# EAGLE design 1tm32 (EAGLE 9.6.2)
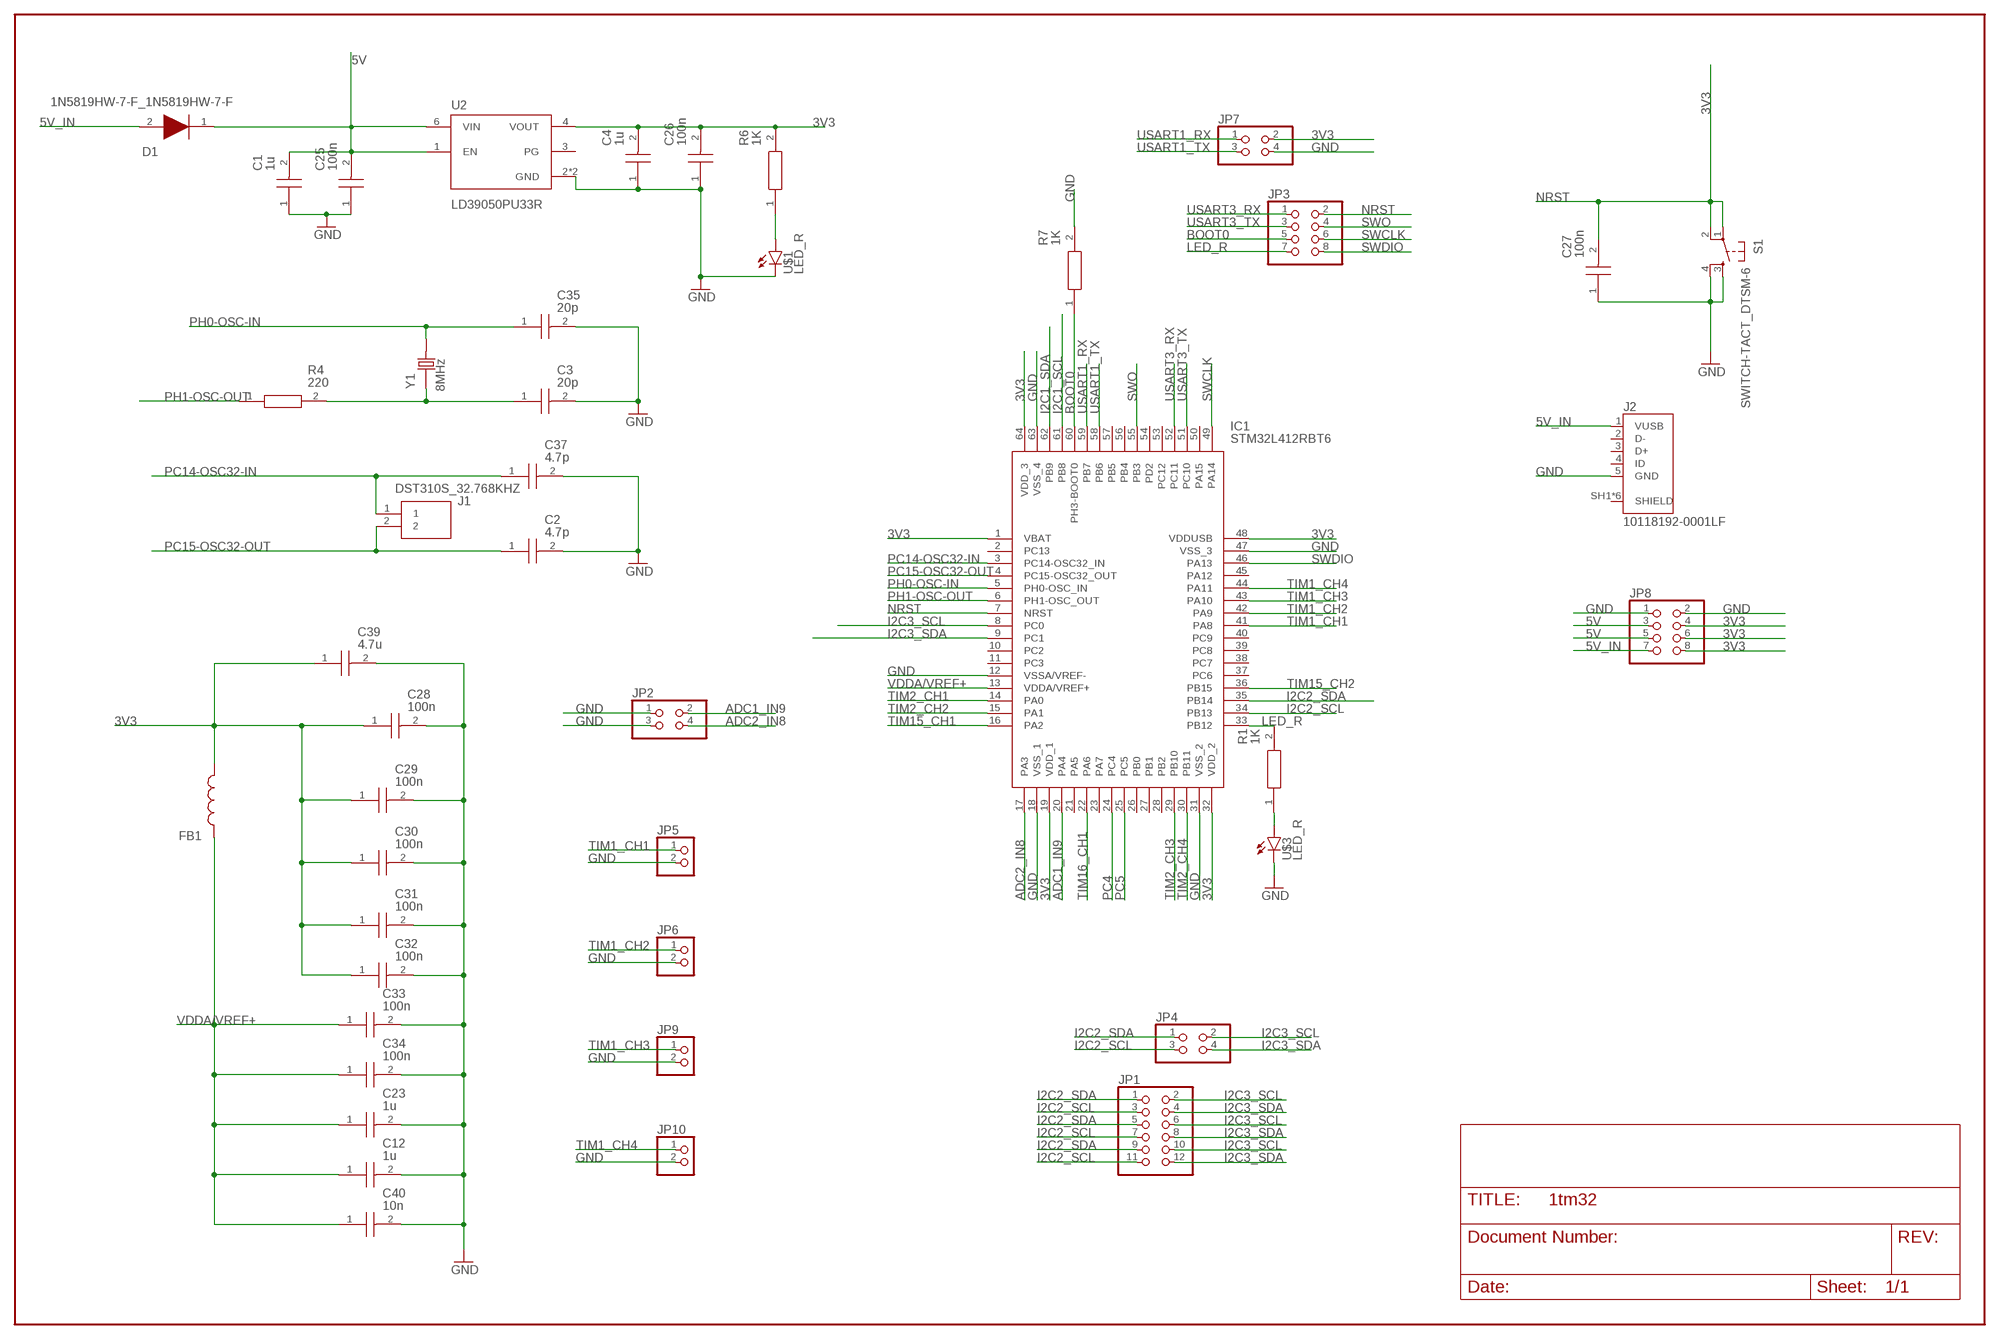
[diagram p0: schematic, sheet 1]

## Parts
C1  1u  GRM219R61H105KA73D  [CAPC2012X95N]
C2  4.7p  GQM2195C2E4R7BB12D  [CAPC2012X100N]
C3  20p  CC0402KPX7R7BB104  [CAPC1005X55N]
C4  1u  GRM219R61H105KA73D  [CAPC2012X95N]
C12  1u  GRM219R61H105KA73D  [CAPC2012X95N]
C23  1u  GRM219R61H105KA73D  [CAPC2012X95N]
C25  100n  GRT31C5C2A104JA12L  [CAPC3216X180N]
C26  100n  GRT31C5C2A104JA12L  [CAPC3216X180N]
C27  100n  GRT31C5C2A104JA12L  [CAPC3216X180N]
C28  100n  GRT31C5C2A104JA12L  [CAPC3216X180N]
C29  100n  GRT31C5C2A104JA12L  [CAPC3216X180N]
C30  100n  GRT31C5C2A104JA12L  [CAPC3216X180N]
C31  100n  GRT31C5C2A104JA12L  [CAPC3216X180N]
C32  100n  GRT31C5C2A104JA12L  [CAPC3216X180N]
C33  100n  GRT31C5C2A104JA12L  [CAPC3216X180N]
C34  100n  GRT31C5C2A104JA12L  [CAPC3216X180N]
C35  20p  CC0402KPX7R7BB104  [CAPC1005X55N]
C37  4.7p  GQM2195C2E4R7BB12D  [CAPC2012X100N]
C39  4.7u  GRT21BC71H475KE13L  [CAPC2012X145N]
C40  10n  GRM31CR73A103KW03L  [CAPC3216X180N]
D1  1N5819HW-7-F_1N5819HW-7-F  [1N5819HW-7-F_SOD3716X145N]
FB1  BK1608HS601-T  [BEADC1608X95N]
IC1  STM32L412RBT6  STM32L412RBT6P  [QFP50P1200X1200X160-64N]
J1  DST310S_32.768KHZ  DST310S_32.768KHZ_DST310S_32.768KHZ  [DST310S_32.768KHZ_DST310S32768KHZ]
J2  10118192-0001LF  [AMPHENOL_10118192-0001LF]
JP1  PINHD-2X6  [2X06]
JP2  PINHD-2X2  [2X02]
JP3  PINHD-2X4  [2X04]
JP4  PINHD-2X2  [2X02]
JP5  PINHD-1X2  [1X02]
JP6  PINHD-1X2  [1X02]
JP7  PINHD-2X2  [2X02]
JP8  PINHD-2X4  [2X04]
JP9  PINHD-1X2  [1X02]
JP10  PINHD-1X2  [1X02]
R1  1K  RC0805FR-131KL  [RESC2012X60N]
R4  220  RC0805FR-10220RL  [RESC2012X60N]
R6  1K  RC0805FR-131KL  [RESC2012X60N]
R7  1K  RC0805FR-131KL  [RESC2012X60N]
S1  SWITCH-TACT_DTSM-6  [SWITCH-TACT_DTSM-6]
U2  LD39050PU33R  [SON95P300X300X100-7N]
U$1  LED_R  SML-P12VTT86  [LED_SML-P11UTT86R]
U$3  LED_R  SML-P12VTT86  [LED_SML-P11UTT86R]
Y1  8MHz  ABLS-8.000MHZ-B2-T  [XTAL_ABLS-8.000MHZ-B2-T]

## Nets
3V3: C4.2 C26.2 C28.1 C29.1 C30.1 C31.1 C32.1 C39.1 FB1.2 IC1.1(VBAT) IC1.19(VDD_1) IC1.32(VDD_2) IC1.48(VDDUSB) IC1.64(VDD_3) JP7.2 JP8.4 JP8.6 JP8.8 R6.2 U2.4(VOUT)
5V: C1.2 C25.2 D1.1(K) JP8.3 JP8.5 U2.1(EN) U2.6(VIN)
5V_IN: D1.2(A) J2.1(VUSB) JP8.7
ADC1_IN9: IC1.20(PA4) JP2.2
ADC2_IN8: IC1.17(PA3) JP2.4
BOOT0: IC1.60(PH3-BOOT0) JP3.5 R7.1
GND: C1.1 C2.2 C3.2 C4.1 C12.2 C23.2 C25.1 C26.1 C27.1 C28.2 C29.2 C30.2 C31.2 C32.2 C33.2 C34.2 C35.2 C37.2 C39.2 C40.2 IC1.12(VSSA/VREF-) IC1.18(VSS_1) IC1.31(VSS_2) IC1.47(VSS_3) IC1.63(VSS_4) J2.5(GND) JP2.1 JP2.3 JP5.2 JP6.2 JP7.4 JP8.1 JP8.2 JP9.2 JP10.2 R7.2 S1.3 S1.4 U2.2(GND) U2.7(GND) U$1.C U$3.C
I2C1_SCL: IC1.61(PB8)
I2C1_SDA: IC1.62(PB9)
I2C2_SCL: IC1.34(PB13) JP1.3 JP1.7 JP1.11 JP4.3
I2C2_SDA: IC1.35(PB14) JP1.1 JP1.5 JP1.9 JP4.1
I2C3_SCL: IC1.8(PC0) JP1.2 JP1.6 JP1.10 JP4.2
I2C3_SDA: IC1.9(PC1) JP1.4 JP1.8 JP1.12 JP4.4
LED_R: IC1.33(PB12) JP3.7 R1.2
N$2: R1.1 U$3.A
N$3: C3.1 R4.2 Y1.1
N$5: R6.1 U$1.A
NRST: C27.2 IC1.7(NRST) JP3.2 S1.1 S1.2
PC4: IC1.24(PC4)
PC5: IC1.25(PC5)
PC14-OSC32-IN: C37.1 IC1.3(PC14-OSC32_IN) J1.1
PC15-OSC32-OUT: C2.1 IC1.4(PC15-OSC32_OUT) J1.2
PH0-OSC-IN: C35.1 IC1.5(PH0-OSC_IN) Y1.2
PH1-OSC-OUT: IC1.6(PH1-OSC_OUT) R4.1
SWCLK: IC1.49(PA14) JP3.6
SWDIO: IC1.46(PA13) JP3.8
SWO: IC1.55(PB3) JP3.4
TIM1_CH1: IC1.41(PA8) JP5.1
TIM1_CH2: IC1.42(PA9) JP6.1
TIM1_CH3: IC1.43(PA10) JP9.1
TIM1_CH4: IC1.44(PA11) JP10.1
TIM2_CH1: IC1.14(PA0)
TIM2_CH2: IC1.15(PA1)
TIM2_CH3: IC1.29(PB10)
TIM2_CH4: IC1.30(PB11)
TIM15_CH1: IC1.16(PA2)
TIM15_CH2: IC1.36(PB15)
TIM16_CH1: IC1.22(PA6)
USART1_RX: IC1.59(PB7) JP7.1
USART1_TX: IC1.58(PB6) JP7.3
USART3_RX: IC1.52(PC11) JP3.1
USART3_TX: IC1.51(PC10) JP3.3
VDDA/VREF+: C12.1 C23.1 C33.1 C34.1 C40.1 FB1.1 IC1.13(VDDA/VREF+)
Unconnected: IC1.2(PC13) IC1.10(PC2) IC1.11(PC3) IC1.21(PA5) IC1.23(PA7) IC1.26(PB0) IC1.27(PB1) IC1.28(PB2) IC1.37(PC6) IC1.38(PC7) IC1.39(PC8) IC1.40(PC9) IC1.45(PA12) IC1.50(PA15) IC1.53(PC12) IC1.54(PD2) IC1.56(PB4) IC1.57(PB5) J2.2(D-) J2.3(D+) J2.4(ID) J2.SH1(SHIELD) J2.SH2(SHIELD) J2.SH3(SHIELD) J2.SH4(SHIELD) J2.SH5(SHIELD) J2.SH6(SHIELD) U2.3(PG)

## Library data of the parts
C1 C4 C12 C23 = GRM219R61H105KA73D(1u):GRM219R61H105KA73D: MURATA - GRM219R61H105KA73D - CAP, MLCC, X5R, 1UF, 50V, 0805 Source: Datasheet <https://datasheet.datasheetarchive.com/originals/distributors/DKDS-10/191852.pdf>; DESCRIPTION: MURATA - GRM219R61H105KA73D - CAP, MLCC, X5R, 1UF, 50V, 0805; HEIGHT: 0.95mm; MANUFACTURER_NAME: Murata Electronics; MANUFACTURER_PART_NUMBER: GRM219R61H105KA73D; MOUSER_PART_NUMBER: 81-GRM219R61H105KA3D; MOUSER_PRICE-STOCK: https://www.mouser.co.uk/ProductDetail/Murata-Electronics/GRM219R61H105KA73D?qs=O5cugoO6nweiD1nCQ5vS9w%3D%3D
C2 C37 = GQM2195C2E4R7BB12D(4_7p):GQM2195C2E4R7BB12D: Capacitor GQM21 L=2.0mm W=1.25mm T=0.85mm Source: Datasheet <https://psearch.en.murata.com/capacitor/product/GQM2195C2E4R7BB12#.html>; DESCRIPTION: Capacitor GQM21 L=2.0mm W=1.25mm T=0.85mm; HEIGHT: 1mm; MANUFACTURER_NAME: Murata Electronics; MANUFACTURER_PART_NUMBER: GQM2195C2E4R7BB12D; MOUSER_PART_NUMBER: 81-GQM2195C2E4R7BB2D; MOUSER_PRICE-STOCK: https://www.mouser.co.uk/ProductDetail/Murata-Electronics/GQM2195C2E4R7BB12D?qs=0JbGSuRBwBOIE8NOw5EJ%2FA%3D%3D
C3 C35 = CC0402KPX7R7BB104(0402cap_foot):CC0402KPX7R7BB104: Multilayer Ceramic Capacitors MLCC - SMD/SMT 16 V 0.1uF X7R 0402 10% Source: Datasheet <https://www.mouser.ca/datasheet/2/447/UPY_NP0X5R_01005_4V_to_25V_V10-3003057.pdf>; DESCRIPTION: Multilayer Ceramic Capacitors MLCC - SMD/SMT 16 V 0.1uF X7R 0402 10%; HEIGHT: 0.55mm; MANUFACTURER_NAME: YAGEO; MANUFACTURER_PART_NUMBER: CC0402KPX7R7BB104; MOUSER_PART_NUMBER: 603-CC402KPX7R7BB104; MOUSER_PRICE-STOCK: https://www.mouser.co.uk/ProductDetail/YAGEO/CC0402KPX7R7BB104?qs=7s%252B3O6pAiyDFg2%2FesnFI7w%3D%3D
C25-C34 = GRT31C5C2A104JA12L(0_1u):GRT31C5C2A104JA12L: Multilayer Ceramic Capacitors MLCC - SMD/SMT Source: Datasheet <https://www.murata.com/en-eu/products/productdetail?partno=GRT31C5C2A104JA12#>; DESCRIPTION: Multilayer Ceramic Capacitors MLCC - SMD/SMT; HEIGHT: 1.8mm; MANUFACTURER_NAME: Murata Electronics; MANUFACTURER_PART_NUMBER: GRT31C5C2A104JA12L; MOUSER_PART_NUMBER: 81-GRT31C5C2A104JA2L; MOUSER_PRICE-STOCK: https://www.mouser.co.uk/ProductDetail/Murata-Electronics/GRT31C5C2A104JA12L?qs=rI7uf1IzohSpYGEFBFd58g%3D%3D
C39 = GRT21BC71H475KE13L(4_7u):GRT21BC71H475KE13L: GRT21BC71H475KE13_ (0805, X7S:EIA, 4.7uF, DC50V) Source: Datasheet <https://search.murata.co.jp/Ceramy/image/img/A01X/G101/ENG/GRT21BC71H475KE13-01.pdf>; DESCRIPTION: GRT21BC71H475KE13_ (0805, X7S:EIA, 4.7uF, DC50V); HEIGHT: 1.45mm; MANUFACTURER_NAME: Murata Electronics; MANUFACTURER_PART_NUMBER: GRT21BC71H475KE13L; MOUSER_PART_NUMBER: 81-GRT21BC71H475KE3L; MOUSER_PRICE-STOCK: https://www.mouser.co.uk/ProductDetail/Murata-Electronics/GRT21BC71H475KE13L?qs=rI7uf1IzohQrtwc9u30k7A%3D%3D
C40 = GRM31CR73A103KW03L(0_01u):GRM31CR73A103KW03L: Murata 3216 GRM 10000pF Ceramic Multilayer Capacitor, 1000 V dc, +125C, X7R Dielectric, +/-10% Source: Datasheet <https://datasheet.datasheetarchive.com/originals/distributors/DKDS-10/192419.pdf>; DESCRIPTION: Murata 3216 GRM 10000pF Ceramic Multilayer Capacitor, 1000 V dc, +125C, X7R Dielectric, +/-10%; HEIGHT: 1.8mm; MANUFACTURER_NAME: Murata Electronics; MANUFACTURER_PART_NUMBER: GRM31CR73A103KW03L; MOUSER_PART_NUMBER: 81-GRM31CR73A103KW3L; MOUSER_PRICE-STOCK: https://www.mouser.co.uk/ProductDetail/Murata-Electronics/GRM31CR73A103KW03L?qs=hNud%2FORuBR1TymPCs4fJcA%3D%3D
D1 = ce-capstone-2022:1N5819HW-7-F_1N5819HW-7-F: Diode Schottky 1A 40V SOD123 Diodes Inc 1N5819HW-7-F, SMT Schottky Diode, 40V 1A, 2-Pin SOD-123 Source: Datasheet <https://datasheet.datasheetarchive.com/originals/distributors/Datasheets-DGA23/1390892.pdf>; ARROW_PART_NUMBER: 1N5819HW-7-F; ARROW_PRICE-STOCK: https://www.arrow.com/en/products/1n5819hw-7-f/diodes-incorporated; DESCRIPTION: Diode Schottky 1A 40V SOD123 Diodes Inc 1N5819HW-7-F, SMT Schottky Diode, 40V 1A, 2-Pin SOD-123; HEIGHT: 1.45mm; MANUFACTURER_NAME: Diodes Inc.; MANUFACTURER_PART_NUMBER: 1N5819HW-7-F; MOUSER_PART_NUMBER: 621-1N5819HW-F; MOUSER_PRICE-STOCK: https://www.mouser.co.uk/ProductDetail/Diodes-Incorporated/1N5819HW-7-F?qs=NQ47qNm99eDyWTEd07miYA%3D%3D
FB1 = ce-capstone:BK1608HS601-T: Ferrite Chip Bead(Lead Free) Source: Datasheet <https://www.tai-tech.com.tw/_upload/files/FCM1608-Series.pdf>; DESCRIPTION: Ferrite Chip Bead(Lead Free); HEIGHT: 0.95mm; MANUFACTURER_NAME: Taiyo Yuden; MANUFACTURER_PART_NUMBER: BK1608HS601-T
IC1 = STM32L412RBT6P:STM32L412RBT6P: ARM Microcontrollers - MCU Source: Datasheet <https://www.st.com/resource/en/datasheet/stm32l412c8.pdf>; DESCRIPTION: ARM Microcontrollers - MCU; HEIGHT: 1.6mm; MANUFACTURER_NAME: STMicroelectronics; MANUFACTURER_PART_NUMBER: STM32L412RBT6P; MOUSER_PART_NUMBER: 511-STM32L412RBT6P; MOUSER_PRICE-STOCK: https://www.mouser.co.uk/ProductDetail/STMicroelectronics/STM32L412RBT6P?qs=l7cgNqFNU1hh%252BU1wOZs5Xg%3D%3D
J1 = ce-capstone-2022:DST310S_32.768KHZ_DST310S_32.768KHZ: SMD Crystal Resonators 32.768KHz +/-20ppm SMD-3215_2P RoHS Source: Datasheet <https://datasheet.lcsc.com/szlcsc/KDS-Daishinku-KDS-32-768KHz-12-5PF-20ppm_C93232.pdf>; DESCRIPTION: SMD Crystal Resonators 32.768KHz +/-20ppm SMD-3215_2P RoHS; HEIGHT: 0.85mm; MANUFACTURER_NAME: KDS Daishinku; MANUFACTURER_PART_NUMBER: DST310S 32.768KHz
J2 = ce-capstone:10118192-0001LF: Single Port 5 Contact Horizontal Right Angle Shielded Micro B USB 2.0 Connector; AVAILABILITY: Unavailable; DESCRIPTION: USB - micro B USB 2.0 Receptacle Connector 5 Position Surface Mount, Right Angle; MF: Amphenol ICC; MP: 10118192-0001LF; PACKAGE: None; PRICE: None
JP1 = pinhead:PINHD-2X6: PIN HEADER
JP2 JP4 JP7 = pinhead:PINHD-2X2: PIN HEADER
JP3 JP8 = pinhead:PINHD-2X4: PIN HEADER
JP5 JP6 JP9 JP10 = pinhead:PINHD-1X2: PIN HEADER
R1 R6 R7 = RC0805FR-131KL:RC0805FR-131KL: Thick Film Resistors - SMD 1 kOhms 250 mW 0805 1% Source: Datasheet <https://datasheet.datasheetarchive.com/originals/distributors/Datasheets_SAMA/902f9e387b938f871d31120f5fc1d65e.pdf>; DESCRIPTION: Thick Film Resistors - SMD 1 kOhms 250 mW 0805 1%; HEIGHT: 0.6mm; MANUFACTURER_NAME: KEMET; MANUFACTURER_PART_NUMBER: RC0805FR-131KL; MOUSER_PART_NUMBER: 603-RC0805FR-131KL; MOUSER_PRICE-STOCK: https://www.mouser.co.uk/ProductDetail/YAGEO/RC0805FR-131KL?qs=m6lXFsvg5e0qJLgmV7HC3Q%3D%3D
R4 = RC0805FR-10220RL:RC0805FR-10220RL: Thick Film Resistors - SMD 220 OHM 1% Source: Datasheet; DESCRIPTION: Thick Film Resistors - SMD 220 OHM 1%; HEIGHT: 0.6mm; MANUFACTURER_NAME: KEMET; MANUFACTURER_PART_NUMBER: RC0805FR-10220RL; MOUSER_PART_NUMBER: 603-RC0805FR-10220RL; MOUSER_PRICE-STOCK: https://www.mouser.co.uk/ProductDetail/YAGEO/RC0805FR-10220RL?qs=m6lXFsvg5e0JpfeoSKi9%252BQ%3D%3D
S1 = ce-capstone-2022:SWITCH-TACT_DTSM-6
U2 = ce-capstone:LD39050PU33R: LD39050 Series 500 mA 3.3 V Fixed Low Noise LDO Voltage Regulator - DFN-6; AVAILABILITY: Unavailable; DESCRIPTION: Linear Voltage Regulator IC 1 Output 500mA 6-DFN _3x3_; MF: STMicroelectronics; MP: LD39050PU33R; PACKAGE: DFN-6 STMicroelectronics; PRICE: None
U$1 U$3 = ce-capstone:SML-P12VTT86: SML-P1 Series Red 0402 Clear 60 mcd 2 V Surface Mount PICOLED LED; AVAILABILITY: Unavailable; DESCRIPTION: Red 630nm LED Indication - Discrete 2V 0402 _1006 Metric_; MF: Rohm; MP: SML-P12VTT86; PACKAGE: 0402 Rohm; PRICE: None
Y1 = ce-capstone:ABLS-8.000MHZ-B2-T: Crystal 8MHz Â±20ppm (Tol) Â±50ppm (Stability) 18pF FUND 80Ohm 2-Pin HC-49/US SMD T/R; AVAILABILITY: Unavailable; DESCRIPTION: 8MHz ±20ppm Crystal 18pF 80 Ohms HC-49/US; MF: Abracon LLC; MP: ABLS-8.000MHZ-B2; PACKAGE: HC-49/US Abracon LLC; PRICE: None

## Board
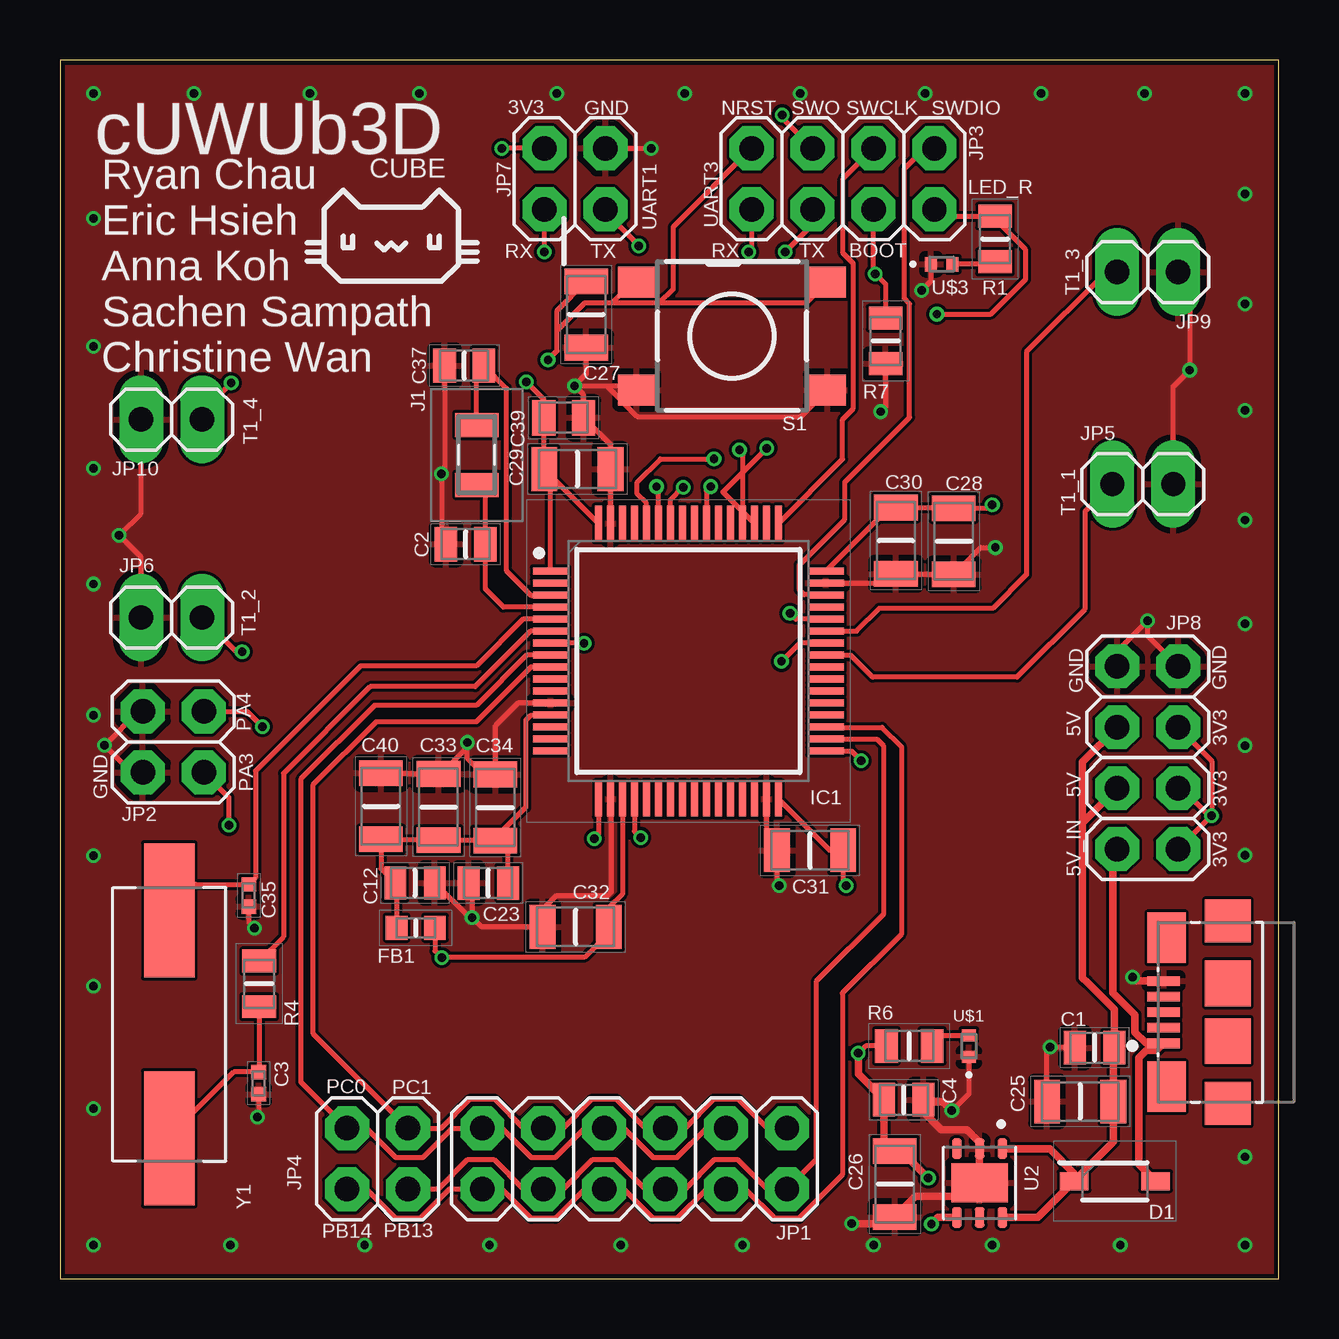
[diagram p1: board, top side]
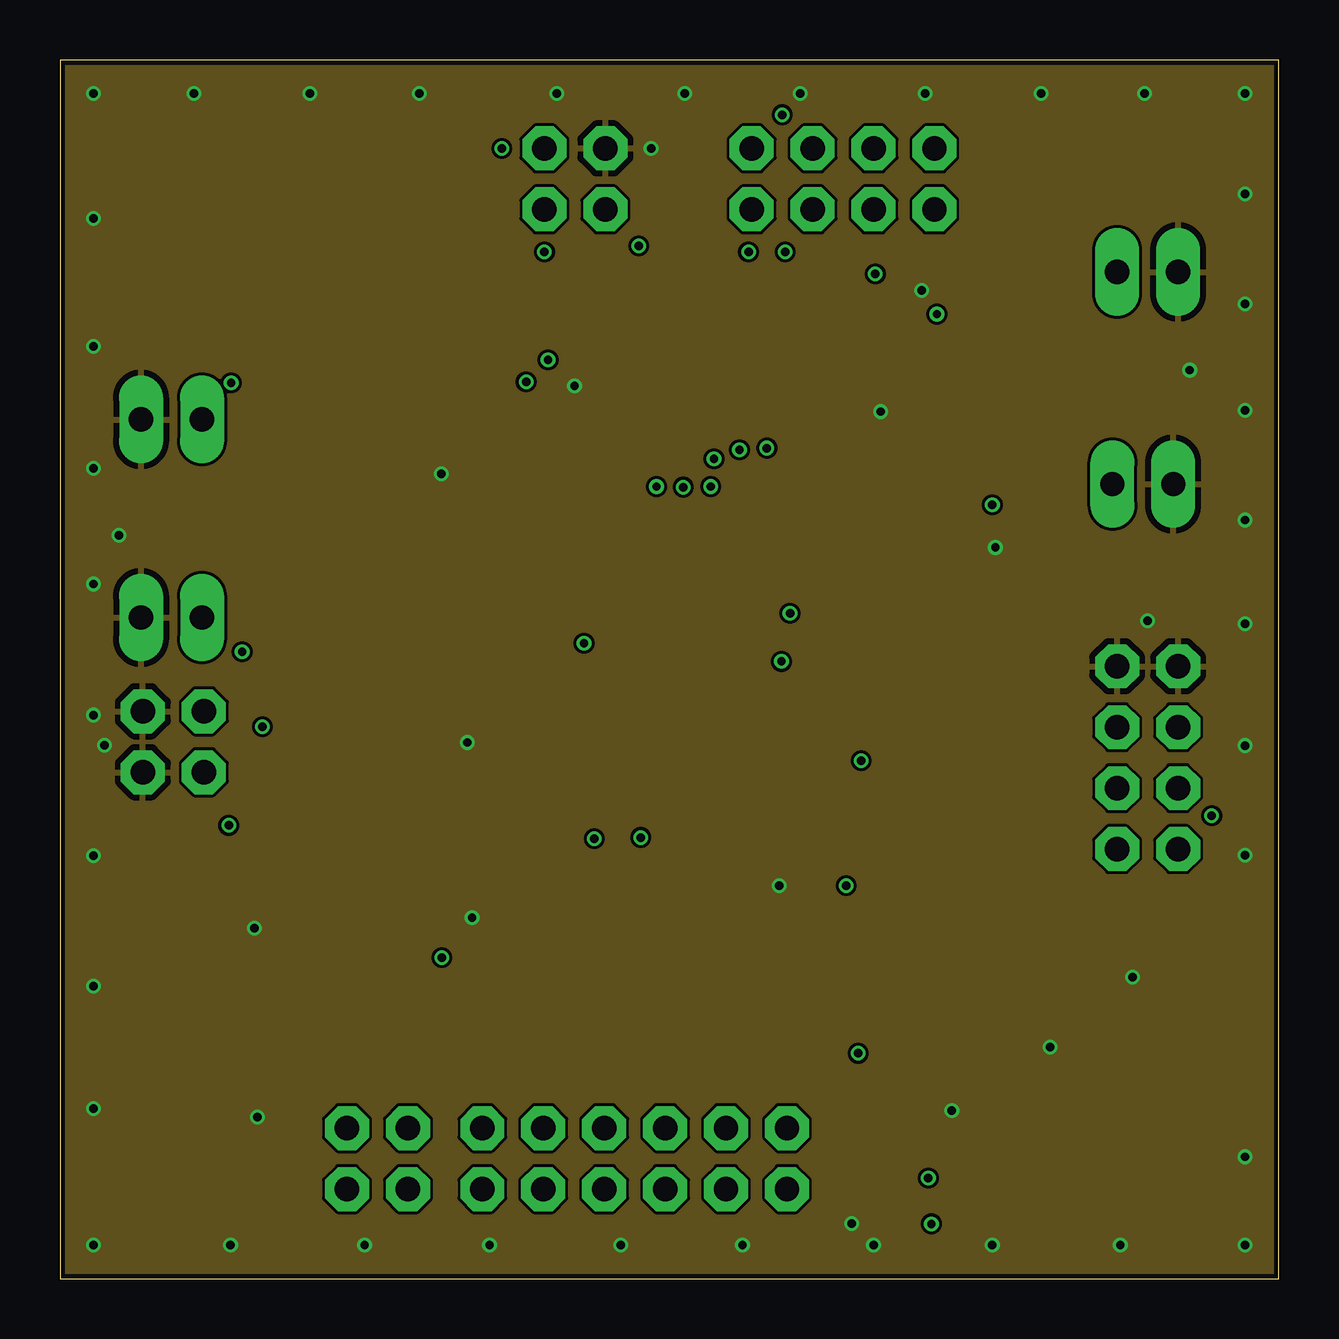
[diagram p2: board, inner layer Route2]
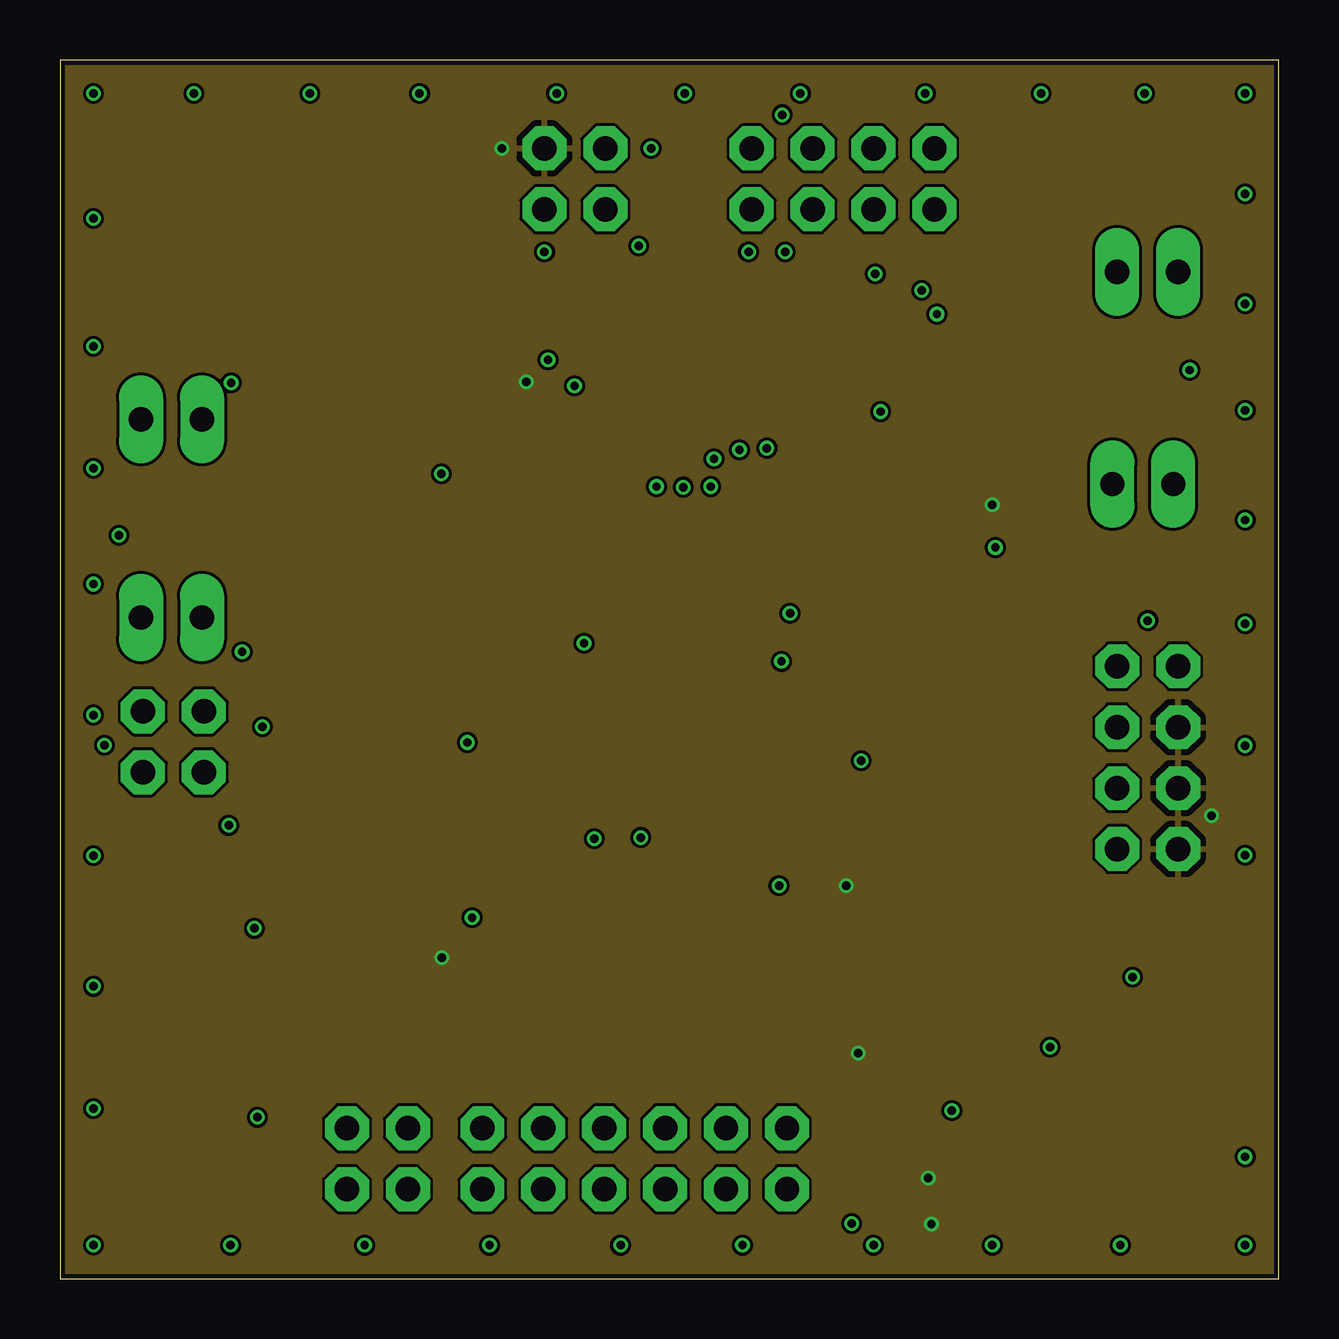
[diagram p3: board, inner layer Route15]
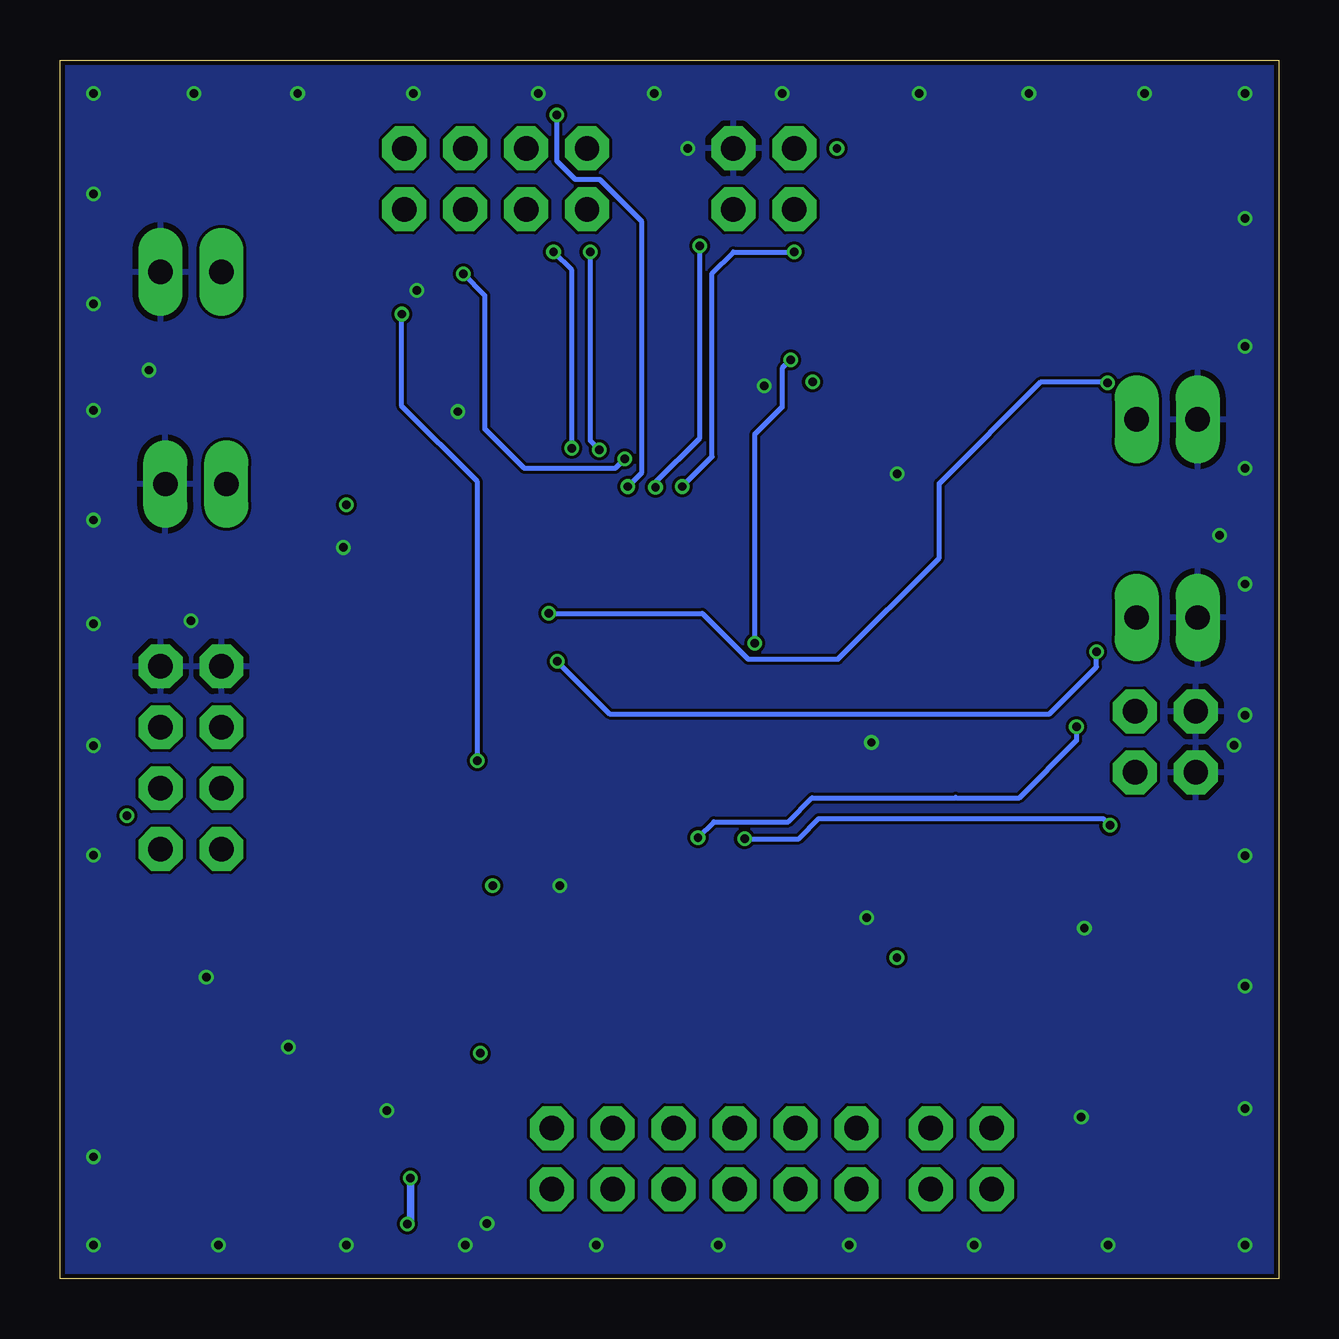
[diagram p4: board, bottom side, seen from below]

Size 50.8 x 50.8 mm. Coordinates in mm from the lower left corner, seen from the top.
Outline: 0,0 50.8,0 50.8,50.8 0,50.8 0,0
Copper layers (1+2*15+16): Top 0.035mm / dielectric 0.2mm / Route2 0.0175mm / dielectric 1.065mm / Route15 0.0175mm / dielectric 0.2mm / Bottom 0.035mm
Design rules "jlcpcb-4layers": minimum track width 3.5mil, minimum drill 0.2mm, track to track 5mil, track to pad 0.2mm, pad to pad 5mil, via to via 0.5mm, smd to smd 5mil, copper to edge 0.2mm, drill to drill 6mil, minimum pad ring 10mil, minimum via ring 0.13mm, stop-mask expansion 0.05mm, vias tented up to drill 16mil, thermal gap 10mil

### Footprints (pad centres in the part's own frame; a part is rotated, then mirrored left to right if it is on the bottom)
CAPC2012X95N = smd 0.91 x 1.39: 1 -0.82,0; 2 0.82,0
CAPC2012X100N = smd 0.94 x 1.43: 1 -0.82,0; 2 0.82,0
CAPC1005X55N = smd 0.6 x 0.62: 1 -0.46,0; 2 0.46,0
CAPC3216X180N = smd 1.07 x 1.82: 1 -1.38,0; 2 1.38,0
CAPC2012X145N = smd 0.97 x 1.47: 1 -0.83,0; 2 0.83,0
1N5819HW-7-F_SOD3716X145N = smd 1.2 x 0.75: 1 -1.7,0; 2 1.7,0
BEADC1608X95N = smd 0.9 x 1: 1 -0.8,0; 2 0.8,0
QFP50P1200X1200X160-64N = smd 1.475 x 0.3: 1 -5.738,3.75; 2 -5.738,3.25; 3 -5.738,2.75; 4 -5.738,2.25; 5 -5.738,1.75; 6 -5.738,1.25; 7 -5.738,0.75; 8 -5.738,0.25; 9 -5.738,-0.25; 10 -5.738,-0.75; 11 -5.738,-1.25; 12 -5.738,-1.75; 13 -5.738,-2.25; 14 -5.738,-2.75; 15 -5.738,-3.25; 16 -5.738,-3.75; 33 5.738,-3.75; 34 5.738,-3.25; 35 5.738,-2.75; 36 5.738,-2.25; 37 5.738,-1.75; 38 5.738,-1.25; 39 5.738,-0.75; 40 5.738,-0.25; 41 5.738,0.25; 42 5.738,0.75; 43 5.738,1.25; 44 5.738,1.75; 45 5.738,2.25; 46 5.738,2.75; 47 5.738,3.25; 48 5.738,3.75 | smd 0.3 x 1.475: 17 -3.75,-5.738; 18 -3.25,-5.738; 19 -2.75,-5.738; 20 -2.25,-5.738; 21 -1.75,-5.738; 22 -1.25,-5.738; 23 -0.75,-5.738; 24 -0.25,-5.738; 25 0.25,-5.738; 26 0.75,-5.738; 27 1.25,-5.738; 28 1.75,-5.738; 29 2.25,-5.738; 30 2.75,-5.738; 31 3.25,-5.738; 32 3.75,-5.738; 49 3.75,5.738; 50 3.25,5.738; 51 2.75,5.738; 52 2.25,5.738; 53 1.75,5.738; 54 1.25,5.738; 55 0.75,5.738; 56 0.25,5.738; 57 -0.25,5.738; 58 -0.75,5.738; 59 -1.25,5.738; 60 -1.75,5.738; 61 -2.25,5.738; 62 -2.75,5.738; 63 -3.25,5.738; 64 -3.75,5.738
DST310S_32.768KHZ_DST310S32768KHZ = smd 1 x 1.8: 1 -1.25,0; 2 1.25,0
AMPHENOL_10118192-0001LF = smd 0.4 x 1.35: 1 -1.3,0; 2 -0.65,0; 3 0,0; 4 0.65,0; 5 1.3,0 | smd 2.1 x 1.6: SH1 -3.1,-0.125; SH2 3.1,-0.125 | smd 1.8 x 1.9: SH3 -3.8,-2.675; SH6 3.8,-2.675 | smd 1.9 x 1.9: SH4 -1.2,-2.675; SH5 1.2,-2.675
2X06 = drill 1.016 octagon: 1 -6.35,-1.27; 2 -6.35,1.27; 3 -3.81,-1.27; 4 -3.81,1.27; 5 -1.27,-1.27; 6 -1.27,1.27; 7 1.27,-1.27; 8 1.27,1.27; 9 3.81,-1.27; 10 3.81,1.27; 11 6.35,-1.27; 12 6.35,1.27
2X02 = drill 1.016 octagon: 1 -1.27,-1.27; 2 -1.27,1.27; 3 1.27,-1.27; 4 1.27,1.27
2X04 = drill 1.016 octagon: 1 -3.81,-1.27; 2 -3.81,1.27; 3 -1.27,-1.27; 4 -1.27,1.27; 5 1.27,-1.27; 6 1.27,1.27; 7 3.81,-1.27; 8 3.81,1.27
1X02 = drill 1.016 long: 1 -1.27,0; 2 1.27,0
RESC2012X60N = smd 0.95 x 1.4: 1 -0.95,0; 2 0.95,0
SWITCH-TACT_DTSM-6 = smd 1.55 x 1.3: 1 -3.975,2.25; 2 3.975,2.25; 3 -3.975,-2.25; 4 3.975,-2.25
SON95P300X300X100-7N = smd 0.84 x 0.4: 1 -1.435,0.95; 2 -1.435,0; 3 -1.435,-0.95; 4 1.435,-0.95; 5 1.435,0; 6 1.435,0.95 | smd 1.625 x 2.365: 7 0,0
LED_SML-P11UTT86R = smd 0.5 x 0.6: A 0.45,0; C -0.45,0
XTAL_ABLS-8.000MHZ-B2-T = smd 5.6 x 2.1: 1 -4.75,0; 2 4.75,0

### Placement (x,y rotation side)
C1  43.12,9.63 0 top
C2  16.91,30.62 180 top
C3  8.28,8.15 270 top
C4  35.17,7.46 180 top
C12  14.8,16.5 0 top
C23  17.85,16.49 180 top
C25  42.52,7.39 0 top
C26  34.8,3.95 90 top
C27  21.94,40.19 90 top
C28  37.25,30.74 270 top
C29  21.57,33.75 0 top
C30  34.84,30.76 270 top
C31  31.26,17.86 180 top
C32  21.49,14.67 180 top
C33  15.78,19.66 90 top
C34  18.15,19.64 90 top
C35  7.87,15.98 270 top
C37  16.85,38.06 180 top
C39  20.99,35.89 0 top
C40  13.38,19.7 90 top
D1  43.97,4.06 0 top
FB1  14.83,14.62 0 top
IC1  26.19,25.74 0 top
J1  17.37,34.34 270 top
J2  46,11.11 90 top
JP1  23.95,5 0 top
JP2  4.72,22.38 270 top
JP3  32.64,45.85 0 top
JP4  13.23,5 0 top
JP5  45.14,33.12 0 top
JP6  4.65,27.56 180 top
JP7  21.46,45.85 0 top
JP8  45.34,21.72 270 top
JP9  45.34,41.96 0 top
JP10  4.65,35.81 180 top
R1  38.98,43.34 90 top
R4  8.3,12.29 270 top
R6  35.4,9.7 180 top
R7  34.41,39.09 270 top
S1  28.02,39.29 0 top
U2  38.33,3.99 270 top
U$1  37.89,9.7 90 top
U$3  36.76,42.28 0 top
Y1  4.56,10.6 90 top

### Tracks (layer width: path | path; a pad name or v marks a point on that pad's centre or on a via)
3V3  (via drill 0.35)
  Top 0.203: 34.8,5.2 C26.2 | IC1.19 23.44,16.02 22.87,15.45 C32.1 22.87,14.41 21.86,13.4 15.93,13.4 v15.91,13.38 15.63,13.66 FB1.2 | R6.2 33.58,9.7 v33.27,9.4 | IC1.64 20.45,33.47 | v19.43,37.39 20.16,36.66 C39.1 20.16,33.77 C29.1 20.19,33.74 20.45,33.47 | IC1.1 20.45,33.47 | IC1.32 32.09,17.86 C31.1 32.64,16.51 v32.77,16.38 | IC1.48 34.58,32.14 C30.1 37.23,32.14 C28.1 38.72,32.12 v38.86,32.26 | JP7.2 v18.41,47.12 | JP8.8 47.94,19.24 | 47.94,19.24 v48.01,19.3 48.01,21.59 JP8.4 | JP8.6 46.74,20.45 47.94,19.24
  Top 0.305: v33.27,9.4 33.27,8.53 C4.2 34.35,5.55 34.8,5.1 34.8,5.2 35.19,5.2 v36.2,4.19 | U2.4 36.59,2.55 v36.32,2.29
  Bottom 0.305: v36.32,2.29 36.2,2.41 v36.2,4.19
  pour Route15: 0,50.8 20.9,50.8 30,50.8 50.8,50.8 50.8,0 0,0
5V
  Top 0.305: 42.62,19 JP8.5 | 42.62,19 42.62,12.54 42.84,12.32 43.94,11.22 C1.2 43.9,9.59 C25.2 43.9,5.7 D1.1 | 42.62,19 42.62,21.54 JP8.3 | D1.1 40.76,2.55 U2.6 | U2.1 39.3,5.41 41.26,5.41 42.27,4.4 D1.1
5V_IN
  Top 0.305: JP8.7 43.89,17.73 43.89,11.92 44.81,11.01 44.81,10.27 45.25,9.83 45.98,9.83 J2.1 45.71,9.52 45.28,9.52 44.97,9.21 44.97,4.76 D1.2
ADC1_IN9  (via drill 0.35)
  Top 0.203: IC1.20 23.94,18.65 v24.21,18.39 | v8.43,23.01 7.8,23.65 JP2.2
  Bottom 0.203: v24.21,18.39 23.55,19.05 20.44,19.05 19.45,20.04 13.49,20.04 13.46,20.07 13.44,20.04 10.82,20.04 8.43,22.43 v8.43,23.01
ADC2_IN8  (via drill 0.35)
  Top 0.203: IC1.17 22.44,18.52 v22.27,18.34 | JP2.4 7.04,20.07 v7.04,18.9
  Bottom 0.203: v22.27,18.34 20,18.34 19.17,19.18 7.32,19.18 v7.04,18.9
BOOT0  (via drill 0.35)
  Top 0.203: v27.26,34.17 25.02,34.17 24.06,33.21 24.06,32.71 24.44,32.32 IC1.60 | R7.1 34.41,41.46 v33.98,41.88 33.91,41.96 JP3.5
  Bottom 0.203: v27.26,34.17 27.65,33.78 31.45,33.78 33.1,35.43 33.1,41 v33.98,41.88
GND  (via drill 0.35)
  Top 0.203: U$1.C 37.89,7.72 v37.17,7 | IC1.63 C29.2 22.95,34.76 C39.2 21.82,36.84 v21.45,37.22 | IC1.12 19.09,23.99 18.15,23.05 C34.2 17.65,21.02 16.98,21.69 16.98,22.14 | C40.2 13.41,21.04 C33.2 15.88,21.04 16.98,22.14 | C23.2 17.18,16.64 v17.18,15.05 | IC1.18 22.97,19.98 22.97,16.11 22.82,15.97 20.68,15.97 20.11,15.4 C32.2 17.56,14.67 v17.18,15.05 | C12.2 17.07,15.05 v17.18,15.05 | 16.98,22.14 v16.98,22.35 | C25.1 41.14,9.52 v41.27,9.65 42.28,9.65 C1.1 | IC1.31 29.44,18.3 C31.2 29.88,16.47 v29.97,16.38 | IC1.47 34.45,28.99 C30.2 37.23,29.38 C28.2 38.38,30.48 v38.99,30.48 | C37.2 16.03,33.69 v15.9,33.55 15.9,30.81 C2.2 | C27.1 21.94,37.71 v21.45,37.22 | JP7.4 v24.64,47.12 | JP8.2 45.34,26.8 v45.34,27.43 44.07,26.16 JP8.1 | JP2.1 3.27,23.65 v1.85,22.23 2.98,21.11 JP2.3 | U$3.C 36.3,41.58 v35.92,41.2 | R7.2 34.41,36.34 v34.21,36.14 | 22.78,37.22 24.05,35.94 30.89,35.94 S1.4 | v21.45,37.22 22.78,37.22 | 22.78,37.22 23.87,37.22 S1.3 | C35.2 7.87,14.83 v8.1,14.61 | C3.2 8.28,6.78 v8.23,6.73 | JP6.2 3.38,30.07 v2.46,30.99 3.38,31.9 JP10.2 | JP9.2 47.09,41.48 v47.09,37.87 46.41,37.19 JP5.2
  Top 0.305: J2.5 44.87,12.41 v44.7,12.57 | v33,2.3 34.53,2.3 C26.1 35.66,3.43 37.77,3.43 U2.7 U2.2 38.33,5.66 38.27,5.72 38.28,5.72 37.8,6.2 36.74,6.2 35.99,6.95 C4.1 36.08,7.37 36.81,7.37 v37.17,7
  other vias: 1.4,1.4 7.11,1.4 12.7,1.4 17.91,1.4 23.37,1.4 28.45,1.4 33.91,1.4 38.86,1.4 44.2,1.4 49.4,1.4 49.4,5.08 49.4,17.65 49.4,22.23 49.4,27.3 49.4,31.62 49.4,36.2 49.4,40.64 49.4,45.21 49.4,49.4 45.21,49.4 40.89,49.4 36.07,49.4 14.99,49.4 10.41,49.4 5.59,49.4 1.4,49.4 1.4,44.2 1.4,38.86 1.4,33.78 1.4,28.96 1.4,23.5 1.4,17.64 1.4,12.19 1.4,7.09 20.7,49.4 26.04,49.4 30.86,49.4
  pour Top: 0,50.8 20.9,50.8 30,50.8 50.8,50.8 50.8,0 0,0
  pour Bottom: 0,50.8 20.9,50.8 30,50.8 50.8,50.8 50.8,0 0,0
  pour Route2: 0,50.8 20.9,50.8 30,50.8 50.8,50.8 50.8,0 0,0
I2C2_SCL
  Top 0.203: IC1.34 34.05,22.49 34.31,22.23 34.31,15.18 31.52,12.39 31.52,4.95 JP1.11 29.48,3.73 28.27,4.95 27.26,4.95 26.04,3.73 JP1.7 24.4,3.73 23.19,4.95 22.18,4.95 20.96,3.73 JP1.3 19.32,3.73 18.11,4.95 16.97,4.95 15.76,3.73 JP4.3
I2C2_SDA
  Top 0.203: IC1.35 34.27,22.99 35.06,22.19 35.06,14.36 32.61,11.91 32.61,4.33 30.81,2.52 29.8,2.52 28.58,3.73 JP1.9 26.94,3.73 25.73,2.52 24.72,2.52 23.5,3.73 JP1.5 21.86,3.73 20.65,2.52 19.64,2.52 18.42,3.73 JP1.1 16.22,3.73 15.01,2.52 14,2.52 12.78,3.73 JP4.1
I2C3_SCL
  Top 0.203: IC1.8 19.45,25.99 17.36,23.9 13.11,23.9 10.03,20.83 10.03,8.2 JP4.2 12.78,6.27 14,5.06 15.13,5.06 16.35,6.27 JP1.2 18.42,6.27 19.64,5.06 20.65,5.06 21.86,6.27 JP1.6 23.5,6.27 24.72,5.06 25.73,5.06 26.94,6.27 JP1.10
I2C3_SDA
  Top 0.203: IC1.9 19.64,25.5 17.35,23.22 13.18,23.22 10.54,20.58 10.54,10.24 JP4.4 15.88,6.27 17.1,7.49 18.11,7.49 19.32,6.27 JP1.4 20.96,6.27 22.18,7.49 23.19,7.49 24.4,6.27 JP1.8 26.04,6.27 27.26,7.49 28.27,7.49 29.48,6.27 JP1.12
LED_R  (via drill 0.35)
  Top 0.203: JP3.7 36.74,44.29 38.86,44.29 | 38.86,44.29 R1.2 | IC1.33 33,21.99 v33.4,21.59 | v36.55,40.21 38.81,40.21 40.26,41.66 40.26,42.89 38.86,44.29
  Bottom 0.203: v33.4,21.59 33.4,33.22 36.55,36.37 v36.55,40.21
N$2
  Top 0.203: R1.1 38.87,42.28 U$3.A
N$3
  Top 0.203: Y1.1 4.56,5.93 7.24,8.61 C3.1 8.3,8.63 R4.2
N$5
  Top 0.203: R6.1 36.8,10.15 U$1.A
NRST  (via drill 0.35)
  Top 0.203: IC1.7 v21.84,26.49 | v20.34,38.3 20.72,38.68 20.72,39.52 | C27.2 20.72,40.36 20.72,39.52 | 20.72,39.52 21.88,40.68 23.01,40.68 | S1.2 31.12,40.68 24.99,40.68 | 23.01,40.68 24.99,40.68 | 23.01,40.68 23.88,41.54 S1.1 | JP3.2 25.55,43.84 25.55,41.23 24.99,40.68
  Bottom 0.203: v20.34,38.3 20.7,37.95 20.7,36.32 21.84,35.18 v21.84,26.49
PC14-OSC32-IN
  Top 0.203: IC1.3 20.42,28.46 19.66,28.46 18.62,29.51 18.62,37.11 C37.1 17.37,37.76 J1.1
PC15-OSC32-OUT
  Top 0.203: IC1.4 18.49,27.99 17.73,28.75 C2.1 17.73,32.73 J1.2
PH0-OSC-IN
  Top 0.203: IC1.5 19.31,27.49 17.36,25.55 12.53,25.55 8.15,21.17 8.15,16.72 C35.1 5.64,16.44 Y1.2
PH1-OSC-OUT
  Top 0.203: R4.1 9.32,14.26 9.32,21.06 12.93,24.68 17.3,24.68 19.62,26.99 IC1.6
SWCLK
  Top 0.203: IC1.49 32.62,34.16 32.62,35.82 33.07,36.27 33.07,42.32 32.64,42.75 32.64,45.85 JP3.6
SWDIO
  Top 0.203: IC1.46 31.93,28.51 31.01,28.51 30.81,28.71 30.81,29.75 32.72,31.65 32.72,33.2 35.41,35.9 35.41,40.64 35.19,40.86 35.19,46.26 36.04,47.12 JP3.8
SWO  (via drill 0.35)
  Top 0.203: JP3.4 30.1,48.39 v30.1,48.51 | v27.13,33.02 26.94,32.84 IC1.55
  Bottom 0.203: v30.1,48.51 30.1,46.59 29.33,45.82 28.31,45.82 26.57,44.08 26.57,33.58 v27.13,33.02
TIM1_CH1
  Top 0.203: IC1.41 32.95,25.99 33.87,25.07 39.89,25.07 42.74,27.92 42.74,32 JP5.1
TIM1_CH2  (via drill 0.35)
  Top 0.203: IC1.42 30.84,26.49 v30.07,25.73 | v7.59,26.14 7.34,26.14 JP6.1
  Bottom 0.203: v30.07,25.73 27.89,23.55 9.55,23.55 7.59,25.5 v7.59,26.14
TIM1_CH3
  Top 0.203: IC1.43 33.2,26.99 34.15,27.94 38.88,27.94 40.28,29.35 40.28,38.63 43.61,41.96 JP9.1
TIM1_CH4  (via drill 0.35)
  Top 0.203: v30.43,27.74 30.67,27.49 IC1.44 | v7.14,37.34 5.92,36.12 JP10.1
  Bottom 0.203: v30.43,27.74 24.03,27.74 22.12,25.83 18.37,25.83 14.15,30.05 14.15,33.15 9.91,37.39 7.19,37.39 v7.14,37.34
USART1_RX  (via drill 0.35)
  Top 0.203: IC1.59 24.94,32.94 v24.87,33.02 | v20.19,42.8 JP7.1
  Bottom 0.203: v24.87,33.02 23.62,34.27 23.62,41.91 22.73,42.8 v20.19,42.8
USART1_TX  (via drill 0.35)
  Top 0.203: IC1.58 25.44,32.46 v25.98,32.99 | v24.13,43.05 22.73,44.45 JP7.3
  Bottom 0.203: v25.98,32.99 25.98,33.2 24.13,35.05 v24.13,43.05
USART3_RX  (via drill 0.35)
  Top 0.203: JP3.1 28.83,42.93 v28.7,42.8 | v28.32,34.55 28.45,34.42 IC1.52
  Bottom 0.203: v28.7,42.8 28.7,34.93 v28.32,34.55
USART3_TX  (via drill 0.35)
  Top 0.203: IC1.51 27.63,32.79 v29.46,34.62 | v30.23,42.8 31.37,43.94 JP3.3
  Bottom 0.203: v29.46,34.62 29.46,42.04 v30.23,42.8
VDDA/VREF+
  Top 0.203: IC1.13 20.43,23.47 19.61,23.47 19.41,23.27 19.41,19.64 18.03,18.26 | 18.03,18.26 C34.1 18.26,18.37 18.67,17.96 C23.1 | 18.03,18.26 15.8,18.26 C33.1 13.41,18.28 C40.1 13.38,17.1 C12.1 14.03,16.45 FB1.1

### Text on the board
tPlace: 3V3 | GND | NRST | SWO | SWCLK | SWDIO | cUWUb3D | CUBE | UART1 | LED_R | UART3 | RX | TX | RX | TX | BOOT | T1_3 | Ryan Chau / Eric Hsieh / Anna Koh / Sachen Sampath / Christine Wan | T1_4 | T1_1 | T1_2 | GND | GND | PA4 | 5V | PA3 | 3V3 | GND | 5V | 3V3 | 5V_IN | 3V3 | PC0 | PC1 | PB14 | PB13